# EAGLE schematic Tapuino-with-mux (EAGLE 7.1.0)
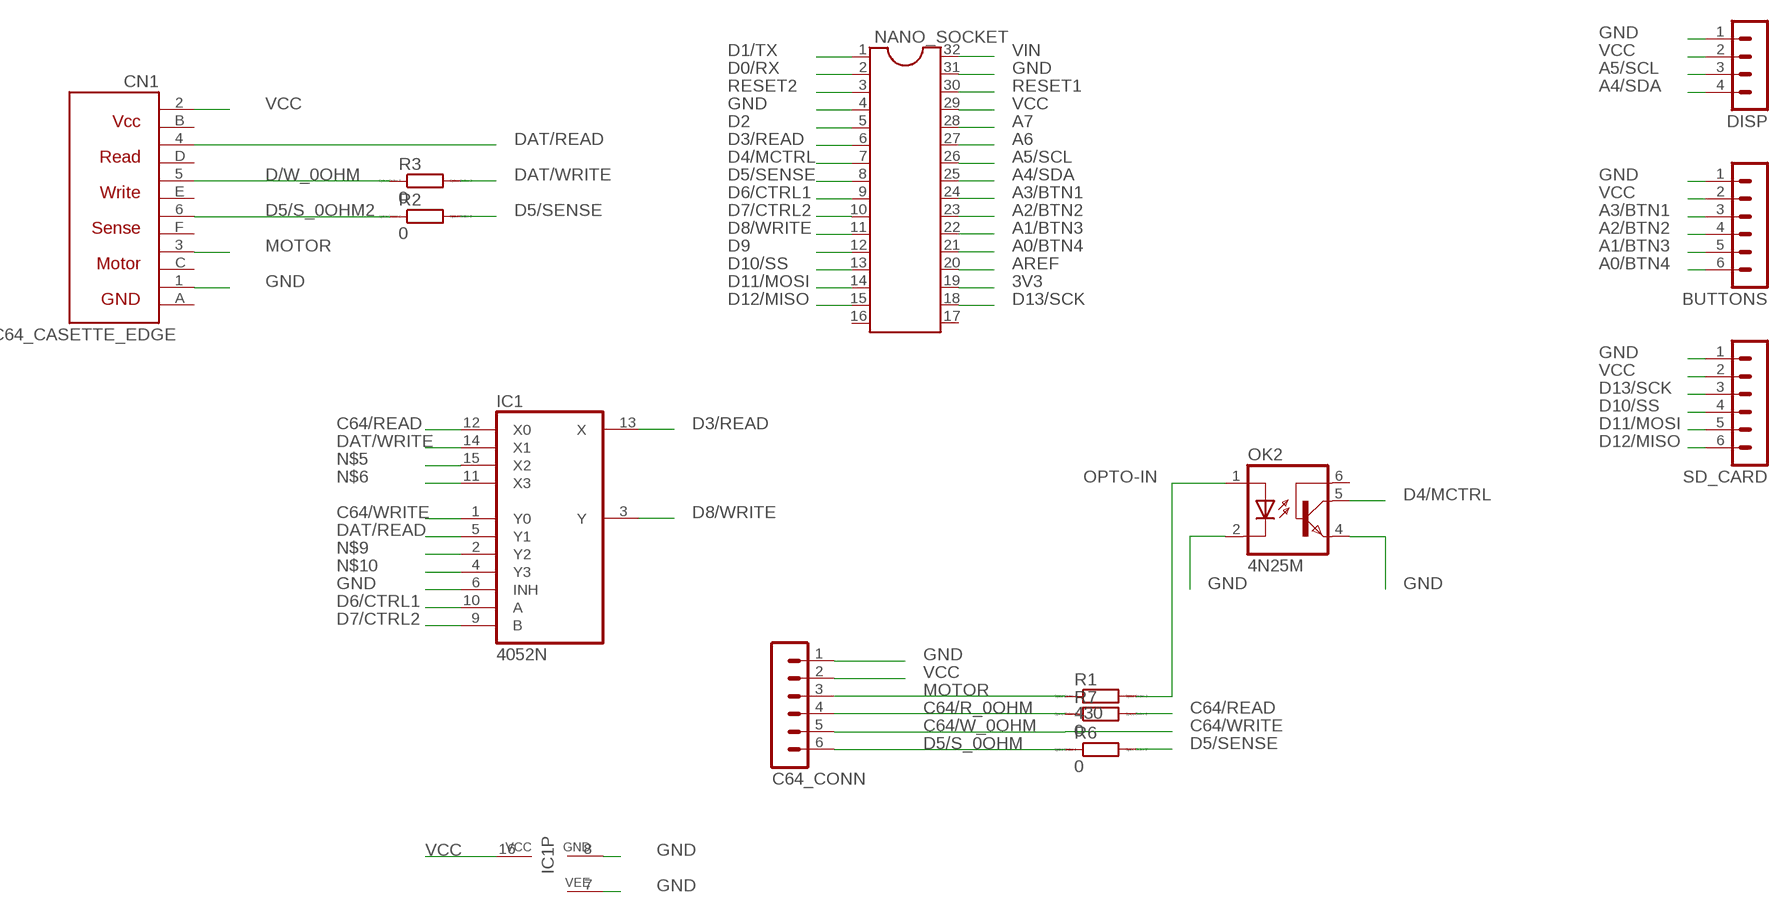
[diagram p0: schematic, sheet 1]

## Parts
BUTTONS  MA06-1  [MA06-1]
C64_CONN  MA06-1  [MA06-1]
CN1  C64_CASETTE_EDGE  [C64_CASSETTE]
DISP  MA04-1  [MA04-1]
IC1  4052N  [DIL16]
NANO_SOCKET  DIL32  [DIL32]
OK2  4N25M  [DIL06]
R1  430  R-EU_0207_10  [0207/10]
R2  0  R-EU_0207_10  [0207/10]
R3  0  R-EU_0207_10  [0207/10]
R6  0  R-EU_0207_5V  [0207/5V]
R7  0  R-EU_0207_10  [0207/10]
SD_CARD  MA06-1  [MA06-1]

## Nets
3V3: NANO_SOCKET.19
A0/BTN4: BUTTONS.6 NANO_SOCKET.21
A1/BTN3: BUTTONS.5 NANO_SOCKET.22
A2/BTN2: BUTTONS.4 NANO_SOCKET.23
A3/BTN1: BUTTONS.3 NANO_SOCKET.24
A4/SDA: DISP.4 NANO_SOCKET.25
A5/SCL: DISP.3 NANO_SOCKET.26
A6: NANO_SOCKET.27
A7: NANO_SOCKET.28
AREF: NANO_SOCKET.20
C64/R_0OHM: C64_CONN.4 R7.1
C64/READ: IC1.12(X0) R7.2
C64/W_0OHM: C64_CONN.5
C64/WRITE: IC1.1(Y0)
D0/RX: NANO_SOCKET.2
D1/TX: NANO_SOCKET.1
D2: NANO_SOCKET.5
D3/READ: IC1.13(X) NANO_SOCKET.6
D4/MCTRL: NANO_SOCKET.7 OK2.5(COL)
D5/S_0OHM: C64_CONN.6 R6.1
D5/S_0OHM2: CN1.6(SENSE1) R2.1
D5/SENSE: NANO_SOCKET.8 R2.2 R6.2
D6/CTRL1: IC1.10(A) NANO_SOCKET.9
D7/CTRL2: IC1.9(B) NANO_SOCKET.10
D8/WRITE: IC1.3(Y) NANO_SOCKET.11
D9: NANO_SOCKET.12
D10/SS: NANO_SOCKET.13 SD_CARD.4
D11/MOSI: NANO_SOCKET.14 SD_CARD.5
D12/MISO: NANO_SOCKET.15 SD_CARD.6
D13/SCK: NANO_SOCKET.18 SD_CARD.3
D/W_0OHM: CN1.5(WRITE1) R3.1
DAT/READ: CN1.4(READ1) IC1.5(Y1)
DAT/WRITE: IC1.14(X1) R3.2
GND: BUTTONS.1 C64_CONN.1 CN1.1(GND1) DISP.1 IC1.6(INH) IC1.7(VEE) IC1.8(GND) NANO_SOCKET.4 NANO_SOCKET.31 OK2.2(C) OK2.4(EMI) SD_CARD.1
MOTOR: C64_CONN.3 CN1.3(MOTOR1) R1.1
N$5: IC1.15(X2)
N$6: IC1.11(X3)
N$9: IC1.2(Y2)
N$10: IC1.4(Y3)
OPTO-IN: OK2.1(A) R1.2
RESET1: NANO_SOCKET.30
RESET2: NANO_SOCKET.3
VCC: BUTTONS.2 C64_CONN.2 CN1.2(VCC1) DISP.2 IC1.16(VCC) NANO_SOCKET.29 SD_CARD.2
VIN: NANO_SOCKET.32
Unconnected: CN1.A(GND2) CN1.B(VCC2) CN1.C(MOTOR2) CN1.D(READ2) CN1.E(WRITE2) CN1.F(SENSE2) NANO_SOCKET.16 NANO_SOCKET.17 OK2.6(BAS)

## Library data of the parts
BUTTONS C64_CONN SD_CARD = con-lstb:MA06-1: PIN HEADER; OC_FARNELL: unknown; OC_NEWARK: unknown
CN1 = commodore:C64_CASETTE_EDGE
DISP = con-lstb:MA04-1: PIN HEADER; OC_FARNELL: unknown; OC_NEWARK: unknown
IC1 = 40xx:4052: Dual 4-channel ANALOG MULTIPLEXER
NANO_SOCKET = ic-package:DIL32: Dual In Line
OK2 = optocoupler:4N*?M: General Purpose 6-Pin Phototransistor Optocouplers Source: http://www.fairchildsemi.com/ds/4N/4N35-M.pdf; MPN: 4N25-M; OC_FARNELL: 1021349; OC_NEWARK: 98K9084
R1-R3 R6 R7 = resistor:R-EU_: RESISTOR, European symbol; SPICEPREFIX: R